# EAGLE design Version 1.3 (EAGLE 9.6.2)
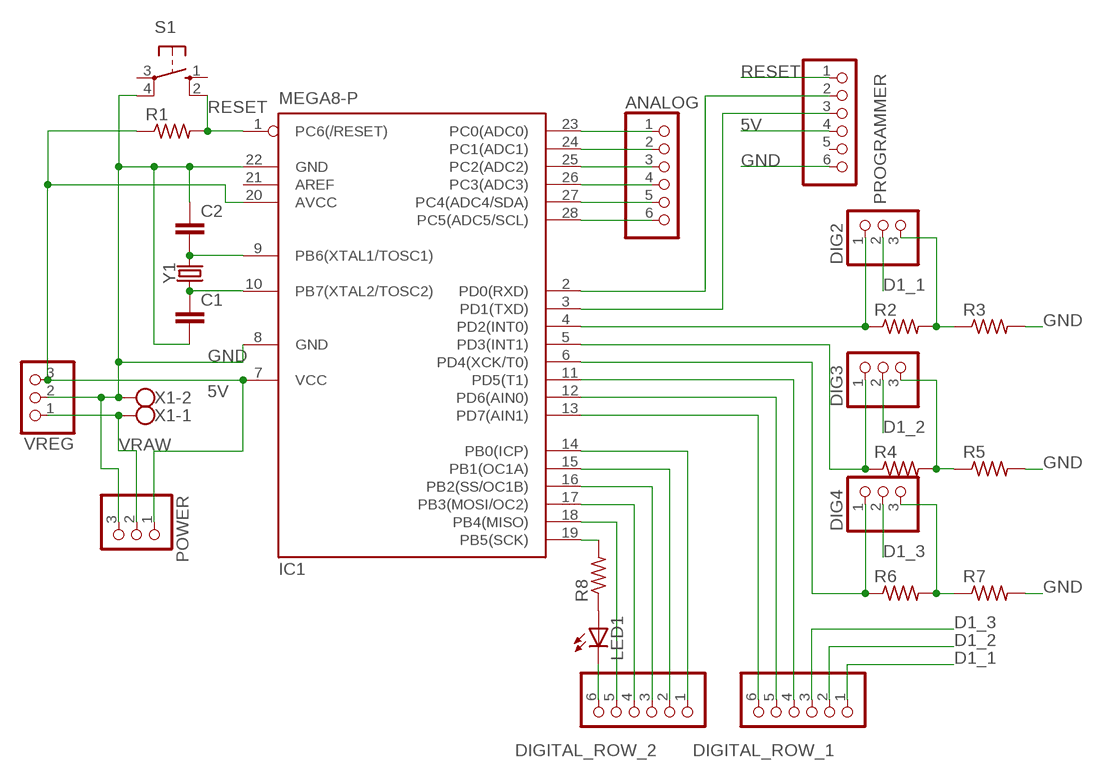
[diagram p0: schematic, sheet 1]

## Parts
ANALOG  PINHD-1X6B  [1X06-BIG]
C1  C2,5-3  [C2.5-3]
C2  C2,5-3  [C2.5-3]
DIG2  PINHD-1X3  [1X03]
DIG3  PINHD-1X3  [1X03]
DIG4  PINHD-1X3  [1X03]
DIGITAL_ROW_1  PINHD-1X6B  [1X06-BIG]
DIGITAL_ROW_2  PINHD-1X6B  [1X06-BIG]
IC1  MEGA8-P  [DIL28-3]
LED1  LED3MM  [LED3MM]
POWER  PINHD-1X3  [1X03]
PROGRAMMER  PINHD-1X6B  [1X06-BIG]
R1  R-US_0204/7  [0204/7]
R2  R-US_0204/7  [0204/7]
R3  R-US_0204/7  [0204/7]
R4  R-US_0204/7  [0204/7]
R5  R-US_0204/7  [0204/7]
R6  R-US_0204/7  [0204/7]
R7  R-US_0204/7  [0204/7]
R8  R-US_0204/7  [0204/7]
S1  10-XX  [B3F-10XX]
VREG  PINHD-1X3CB  [1X03-CLEANBIG]
X1  W237-102  [W237-102]
Y1  CRYSTALPTH-HC49US  [HC49US]

## Nets
5V: IC1.7(VCC) IC1.20(AVCC) POWER.1 PROGRAMMER.4 R1.1 VREG.3
D1_1: DIG2.2 DIGITAL_ROW_1.1
D1_2: DIG3.2 DIGITAL_ROW_1.2
D1_3: DIG4.2 DIGITAL_ROW_1.3
GND: C1.2 C2.1 IC1.8(GND) IC1.22(GND) POWER.3 PROGRAMMER.6 R3.2 R5.2 R7.2 S1.4(P1) VREG.2 X1.2
N$1: C2.2 IC1.9(PB6(XTAL1/TOSC1)) Y1.2
N$2: C1.1 IC1.10(PB7(XTAL2/TOSC2)) Y1.1
N$3: DIG2.3 R2.2 R3.1
N$4: LED1.A R8.1
N$5: ANALOG.1 IC1.23(PC0(ADC0))
N$6: ANALOG.2 IC1.24(PC1(ADC1))
N$7: IC1.2(PD0(RXD)) PROGRAMMER.2
N$8: IC1.3(PD1(TXD)) PROGRAMMER.3
N$9: ANALOG.3 IC1.25(PC2(ADC2))
N$10: ANALOG.4 IC1.26(PC3(ADC3))
N$11: ANALOG.5 IC1.27(PC4(ADC4/SDA))
N$12: ANALOG.6 IC1.28(PC5(ADC5/SCL))
N$13: DIG3.1 IC1.5(PD3(INT1)) R4.1
N$14: DIGITAL_ROW_1.6 IC1.13(PD7(AIN1))
N$15: DIGITAL_ROW_1.5 IC1.12(PD6(AIN0))
N$16: DIGITAL_ROW_1.4 IC1.11(PD5(T1))
N$17: DIG3.3 R4.2 R5.1
N$18: DIGITAL_ROW_2.1 IC1.14(PB0(ICP))
N$19: DIGITAL_ROW_2.2 IC1.15(PB1(OC1A))
N$20: DIGITAL_ROW_2.3 IC1.16(PB2(SS/OC1B))
N$21: DIGITAL_ROW_2.4 IC1.17(PB3(MOSI/OC2))
N$22: DIGITAL_ROW_2.5 IC1.18(PB4(MISO))
N$23: IC1.19(PB5(SCK)) R8.2
N$24: DIG2.1 IC1.4(PD2(INT0)) R2.1
N$25: DIG4.1 IC1.6(PD4(XCK/T0)) R6.1
N$26: DIG4.3 R6.2 R7.1
N$27: DIGITAL_ROW_2.6 LED1.K(C)
RESET: IC1.1(PC6(/RESET)) PROGRAMMER.1 R1.2 S1.2(S1)
VRAW: POWER.2 VREG.1 X1.1
Unconnected: IC1.21(AREF) PROGRAMMER.5 S1.1(S) S1.3(P)

## Library data of the parts
ANALOG DIGITAL_ROW_1 DIGITAL_ROW_2 PROGRAMMER = adafruit:PINHD-1X6: PIN HEADER
C1 C2 = capacitor-wima:C: CAPACITOR naming: grid - package width
DIG2-DIG4 POWER VREG = adafruit:PINHD-1X3: PIN HEADER
IC1 = atmel:MEGA8-P: MICROCONTROLLER 8 Kbytes FLASH, 1 kbytes SRAM, 512 bytes EEPROM, USART, 4-channel 10 bit ADC, 2-channel 8 bit ADC Pin compatible with Atmega48, ATMega88, ATMega168 Source: avr.lbr; OC_FARNELL: unknown; OC_NEWARK: unknown
LED1 = adafruit:LED: LED OSRAM: - CHIPLED LG R971, LG N971, LY N971, LG Q971, LY Q971, LO R971, LY R971 LH N974, LH R974 LS Q976, LO Q976, LY Q976 LO Q996 - Hyper CHIPLED LW Q18S LB Q993, LB Q99A, LB R99A - SideLED LS A670, LO A670, LY A670, LG A670, LP A670 LB A673, LV A673, LT A673, LW A673 LH A674 LY A675 LS A676, LA A676, LO A676, LY A676, LW A676 LS A679, LY A679, LG A679 - Hyper Micro SIDELED® LS Y876, LA Y876, LO Y876, LY Y876 LT Y87S - SmartLED LW L88C, LW L88S LB L89C, LB L89S, LG L890 LS L89K, LO L89K, LY L89K LS L896, LA L896, LO L896, LY L896 - TOPLED LS T670, LO T670, LY T670, LG T670, LP T670 LSG T670, LSP T670, LSY T670, LOP T670, LYG T670 LG T671, LOG T671, LSG T671 LB T673, LV T673, LT T673, LW T673 LH T674 LS T676, LA T676, LO T676, LY T676, LB T676, LH T676, LSB T676, LW T676 LB T67C, LV T67C, LT T67C, LS T67K, LO T67K, LY T67K, LW E67C LS E67B, LA E67B, LO E67B, LY E67B, LB E67C, LV E67C, LT E67C LW T67C LS T679, LY T679, LG T679 LS T770, LO T770, LY T770, LG T770, LP T770 LB T773, LV T773, LT T773, LW T773 LH T774 LS E675, LA E675, LY E675, LS T675 LS T776, LA T776, LO T776, LY T776, LB T776 LHGB T686 LT T68C, LB T68C - Hyper Mini TOPLED® LB M676 - Mini TOPLED Santana® LG M470 LS M47K, LO M47K, LY M47K Source: http://www.osram.convergy.de/
R1-R8 = adafruit:R-US_: RESISTOR, American symbol
S1 = switch-omron:10-XX: OMRON SWITCH; MPN: B3F-1000; OC_FARNELL: 176432; OC_NEWARK: 36M3542
X1 = con-wago-500:W237-102: WAGO SCREW CLAMP; MPN: 237-102; OC_FARNELL: unknown; OC_NEWARK: 70K9898
Y1 = SparkFun-Clocks:CRYSTAL: Crystals (Generic) These are passive quartz crystals, which can be used as a clock source for a microcontroller. Crystal's are two-terminal devices. They require external "load" capacitors to generate an oscillating signal.

## Board
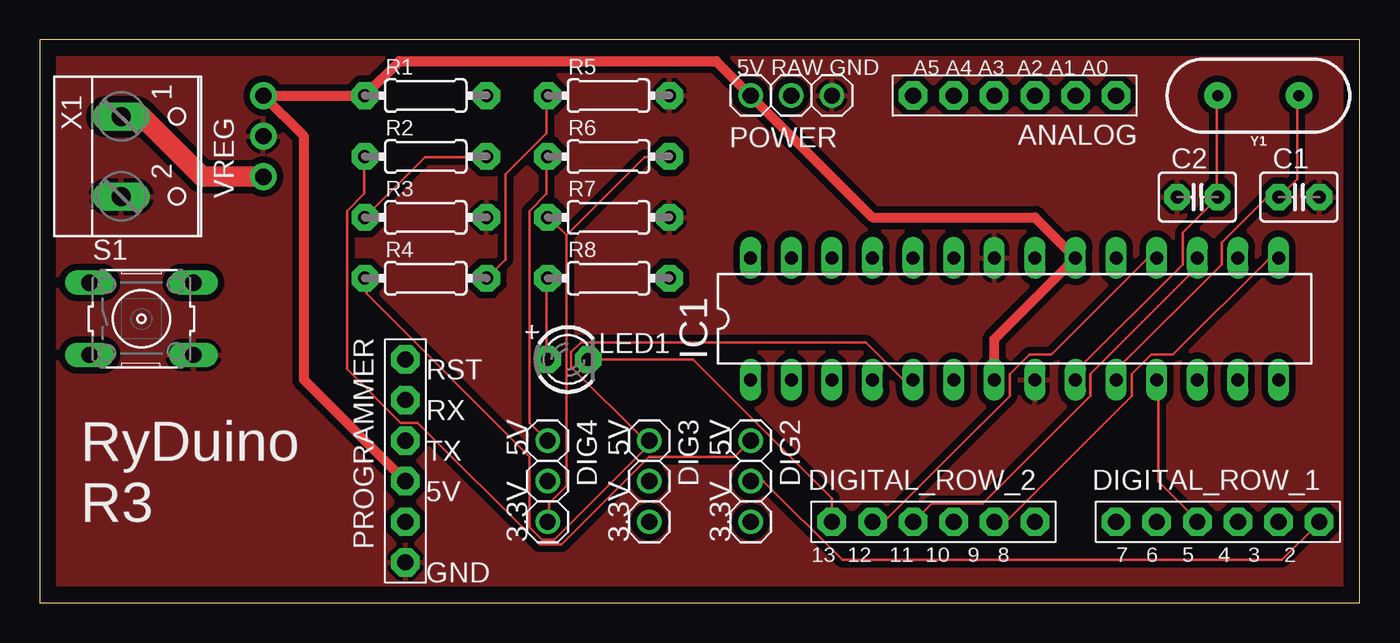
[diagram p1: board, top side]
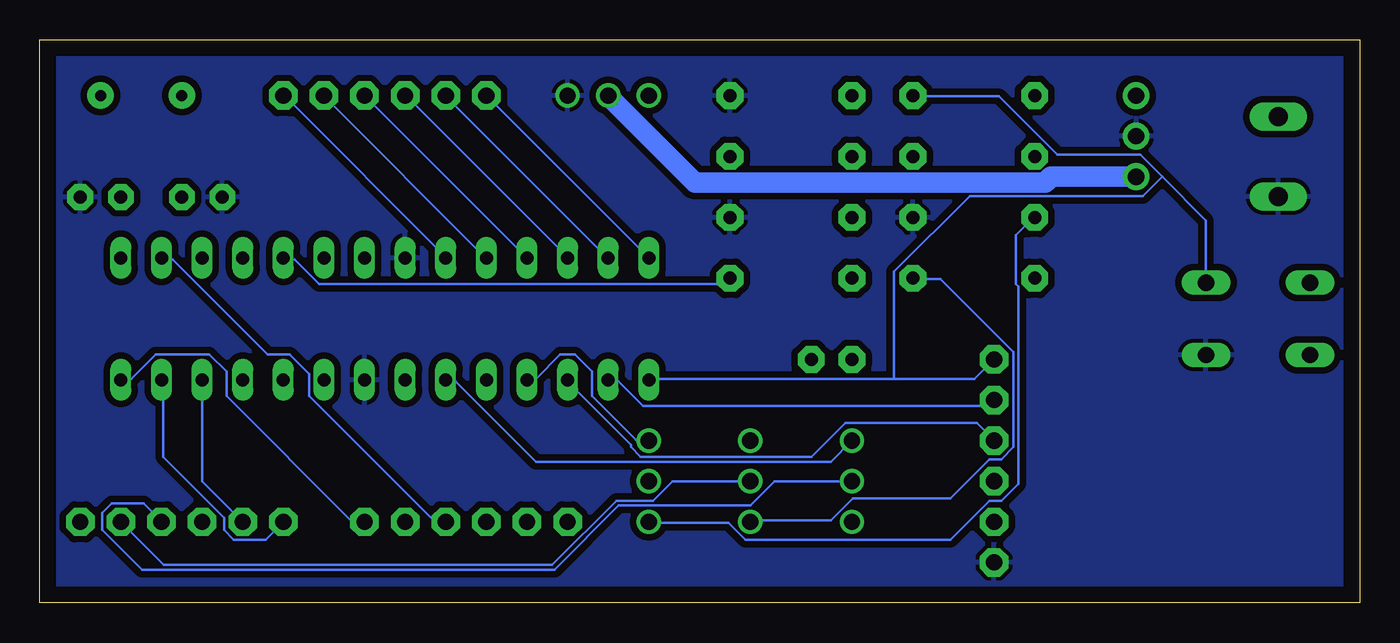
[diagram p2: board, bottom side, seen from below]

Size 82.53 x 35.23 mm. Coordinates in mm from the lower left corner, seen from the top.
Outline: 0,0 82.53,0 82.53,35.23 0,35.23 0,0
Copper layers (1*16): Top 0.035mm / dielectric 1.5mm / Bottom 0.035mm
Design rules "default": minimum track width 6mil, minimum drill 0.35mm, track to track 6mil, track to pad 6mil, pad to pad 6mil, via to via 6mil, smd to smd 6mil, copper to edge 40mil, drill to drill 6mil, minimum pad ring 10mil, minimum via ring 8mil, stop-mask expansion 4mil, vias tented up to drill 0mil, thermal gap 10mil

### Footprints (pad centres in the part's own frame; a part is rotated, then mirrored left to right if it is on the bottom)
1X06-BIG = drill 1.016 pad 1.778 octagon: 1 -6.35,0; 2 -3.81,0; 3 -1.27,0; 4 1.27,0; 5 3.81,0; 6 6.35,0
C2.5-3 = drill 0.813 pad 1.6 octagon: 1 -1.27,0; 2 1.27,0
1X03 = drill 1.016: 1 -2.54,0; 2 0,0; 3 2.54,0
DIL28-3 = drill 0.813 long: 1 -16.51,-3.81; 2 -13.97,-3.81; 3 -11.43,-3.81; 4 -8.89,-3.81; 5 -6.35,-3.81; 6 -3.81,-3.81; 7 -1.27,-3.81; 8 1.27,-3.81; 9 3.81,-3.81; 10 6.35,-3.81; 11 8.89,-3.81; 12 11.43,-3.81; 13 13.97,-3.81; 14 16.51,-3.81; 15 16.51,3.81; 16 13.97,3.81; 17 11.43,3.81; 18 8.89,3.81; 19 6.35,3.81; 20 3.81,3.81; 21 1.27,3.81; 22 -1.27,3.81; 23 -3.81,3.81; 24 -6.35,3.81; 25 -8.89,3.81; 26 -11.43,3.81; 27 -13.97,3.81; 28 -16.51,3.81
LED3MM = drill 0.813 pad 1.676 octagon: A -1.27,0; K 1.27,0
0204/7 = drill 0.813 pad 1.676 octagon: 1 -3.81,0; 2 3.81,0
B3F-10XX = drill 1.016 long: 1 -3.251,2.261; 2 3.251,2.261; 3 -3.251,-2.261; 4 3.251,-2.261
1X03-CLEANBIG = drill 1.016 pad 1.676: 1 -2.54,0; 2 0,0; 3 2.54,0
W237-102 = drill 1.194 long: 1 -2.5,-1.27; 2 2.5,-1.27
HC49US = drill 0.7 pad 1.651: 1 -2.54,0; 2 2.54,0

### Placement (x,y rotation side)
ANALOG  60.96,31.75 180 top
C1  78.74,25.4 0 top
C2  72.39,25.4 0 top
DIG2  44.45,7.62 270 top
DIG3  38.1,7.62 270 top
DIG4  31.75,7.62 270 top
DIGITAL_ROW_1  73.66,5.08 180 top
DIGITAL_ROW_2  55.88,5.08 180 top
IC1  60.96,17.78 0 top
LED1  33.02,15.24 0 top
POWER  46.99,31.75 0 top
PROGRAMMER  22.86,8.89 270 top
R1  24.13,31.75 0 top
R2  24.13,27.94 0 top
R3  24.13,24.13 0 top
R4  24.13,20.32 0 top
R5  35.56,31.75 0 top
R6  35.56,27.94 0 top
R7  35.56,24.13 0 top
R8  35.56,20.32 0 top
S1  6.35,17.78 0 top
VREG  13.97,29.21 90 top
X1  6.35,27.94 270 top
Y1  76.2,31.75 180 top

### Tracks (layer width: path | path; a pad name or v marks a point on that pad's centre or on a via)
5V
  Top 0.61: IC1.7 59.69,16.51 IC1.20 62.23,24.13 52.07,24.13 POWER.1 42.29,33.91 22.48,33.91 R1.1 VREG.3 16.51,29.21 16.51,13.97 PROGRAMMER.4
D1_1
  Top 0.152: DIG2.2 45.26,7.62 50.19,2.69 77.67,2.69 80.01,5.03 DIGITAL_ROW_1.1
D1_2
  Bottom 0.152: DIG3.2 42.98,7.62 44.2,6.4 46.48,6.4 50.49,2.39 74.78,2.39 DIGITAL_ROW_1.2
D1_3
  Bottom 0.152: DIG4.2 36.58,7.62 38.1,6.1 46.33,6.1 50.34,2.08 76.15,2.08 78.64,4.57 78.64,5.64 78.03,6.25 76.05,6.25 74.98,5.18 DIGITAL_ROW_1.3
GND
  pour Top (isolate 0.406): 0,0 0,35.56 82.55,35.56 82.55,0
  pour Bottom (isolate 0.406): 0,0 0,35.56 82.55,35.56 82.55,0
N$1
  Top 0.152: IC1.9 64.77,14.48 71.48,21.18 71.48,23.16 73.61,25.3 C2.2 73.61,25.45 73.61,31.7 Y1.2
N$2
  Top 0.152: IC1.10 67.36,14.02 67.36,14.63 73.91,21.18 73.91,22.55 76.66,25.3 77.42,25.3 C1.1 77.57,25.45 78.64,26.52 78.64,31.7 Y1.1
N$3
  Top 0.152: R3.1 24.08,27.89 27.89,27.89 R2.2
  Bottom 0.152: DIG2.3 44.35,5.03 39.47,5.03 38.41,3.96 25.6,3.96 23.16,6.4 22.4,6.4 21.34,7.47 21.34,19.81 21.49,19.96 21.49,23.01 20.42,24.08 R3.1
N$4
  Top 0.152: LED1.A 31.7,15.24 31.7,20.27 R8.1
N$5
  Bottom 0.152: IC1.23 57.15,21.64 67.21,31.7 ANALOG.1
N$6
  Bottom 0.152: IC1.24 54.71,21.64 64.77,31.7 ANALOG.2
N$7
  Bottom 0.152: IC1.2 46.94,13.87 46.33,13.87 44.81,12.34 23.16,12.34 22.86,12.65 PROGRAMMER.2
N$8
  Bottom 0.152: IC1.3 49.53,13.87 45.57,9.91 45.57,9.75 44.96,9.14 34.29,9.14 32.16,11.28 23.93,11.28 22.86,10.21 PROGRAMMER.3
N$9
  Bottom 0.152: ANALOG.3 IC1.25
N$10
  Bottom 0.152: IC1.26 49.53,21.64 59.59,31.7 ANALOG.4
N$11
  Bottom 0.152: IC1.27 47.09,21.64 57.15,31.7 ANALOG.5
N$12
  Bottom 0.152: ANALOG.6 IC1.28
N$13
  Top 0.152: IC1.5 54.56,14.02 53.95,14.02 51.66,16.31 33.83,16.31 33.22,15.7 33.22,14.78 37.8,10.21 38.1,10.21 DIG3.1 38.1,9.91 32.16,3.96 31.39,3.96 30.63,4.72 30.63,9.14 20.42,19.36 20.42,20.27 R4.1
N$14
  Bottom 0.152: DIGITAL_ROW_1.6 68.43,3.96 70.41,3.96 71.02,4.57 71.02,5.33 74.83,9.14 74.83,13.87 IC1.13
N$15
  Bottom 0.152: IC1.12 72.39,7.62 DIGITAL_ROW_1.5
N$16
  Top 0.152: IC1.11 69.95,13.87 69.95,7.62 72.39,5.18 DIGITAL_ROW_1.4
N$17
  Top 0.152: R4.2 29.11,21.49 29.11,26.82 31.7,29.41 31.7,31.7 R5.1
  Bottom 0.152: DIG3.3 38.1,5.18 33.07,5.18 31.7,6.55 25.6,6.55 23.16,8.99 22.4,8.99 21.64,9.75 21.64,15.7 26.21,20.27 27.89,20.27 R4.2
N$18
  Bottom 0.152: IC1.14 77.42,14.02 76.81,14.02 75.29,15.54 71.93,15.54 70.87,14.48 70.87,12.95 63.09,5.18 62.33,5.18 DIGITAL_ROW_2.1
N$19
  Top 0.152: IC1.15 77.42,21.49 76.81,21.49 70.87,15.54 69.49,15.54 68.28,14.33 68.28,12.95 60.5,5.18 59.74,5.18 DIGITAL_ROW_2.2
N$20
  Bottom 0.152: IC1.16 74.83,21.49 74.22,21.49 68.28,15.54 66.9,15.54 65.68,14.33 65.68,12.95 57.91,5.18 57.15,5.18 DIGITAL_ROW_2.3
N$21
  Top 0.152: IC1.17 72.39,21.03 65.68,14.33 65.68,12.95 58.98,6.25 55.78,6.25 DIGITAL_ROW_2.4
N$22
  Top 0.152: IC1.18 69.8,21.49 69.19,21.49 63.25,15.54 61.87,15.54 60.66,14.33 60.66,12.95 52.88,5.18 52.12,5.18 DIGITAL_ROW_2.5
N$23
  Bottom 0.152: IC1.19 67.21,21.49 66.6,21.49 65.08,19.96 39.78,19.96 39.47,20.27 R8.2
N$24
  Top 0.152: DIG2.1 43.43,9.14 38.1,9.14 32.61,3.66 31.24,3.66 23.62,11.28 22.55,11.28 19.2,14.63 19.2,24.54 20.27,25.6 20.27,27.89 R2.1
  Bottom 0.152: IC1.4 51.97,14.02 51.51,14.02 49.99,15.54 49.07,15.54 48.01,14.48 48.01,12.95 45.26,10.21 44.5,10.21 DIG2.1
N$25
  Top 0.152: DIG4.1 30.63,11.28 30.63,24.54 31.7,25.6 31.7,27.89 R6.1
  Bottom 0.152: DIG4.1 33.07,8.84 51.51,8.84 56.54,13.87 57.15,13.87 IC1.6
N$26
  Top 0.152: 32.92,23.01 32.92,7.32 31.85,6.25 31.85,5.18 DIG4.3 | 32.92,23.01 31.85,24.08 R7.1 | 32.92,23.01 37.8,27.89 39.32,27.89 R6.2
N$27
  Top 0.152: LED1.K 40.84,15.24 49.53,6.55 DIGITAL_ROW_2.6
RESET
  Bottom 0.152: 29.11,14.02 24.08,14.02 PROGRAMMER.1 | 29.11,14.02 44.35,14.02 IC1.1 | S1.2 9.6,23.93 12.34,26.67 | 12.34,26.67 13.72,28.04 18.9,28.04 22.55,31.7 27.89,31.7 R1.2 | 29.11,14.02 29.11,20.73 24.38,25.45 13.56,25.45 12.34,26.67
VRAW
  Top 1.27: X1.1 6.39,30.44 10.16,26.67 VREG.1
  Bottom 1.27: VREG.1 19.29,26.67 19.65,26.31 41.55,26.31 POWER.2

### Text on the board
tPlace: 5V RAW GND | A5 A4 A3 A2 A1 A0 | RST | RX | TX | 5V | RyDuino / R3 | 3.3V 5V | 3.3V 5V | 3.3V 5V | 13 12 11 10 9 8 | 7 6 5 4 3 2 | GND